# Altium schematic sheet [09] - AFE.SchDoc (part 2 of 3)
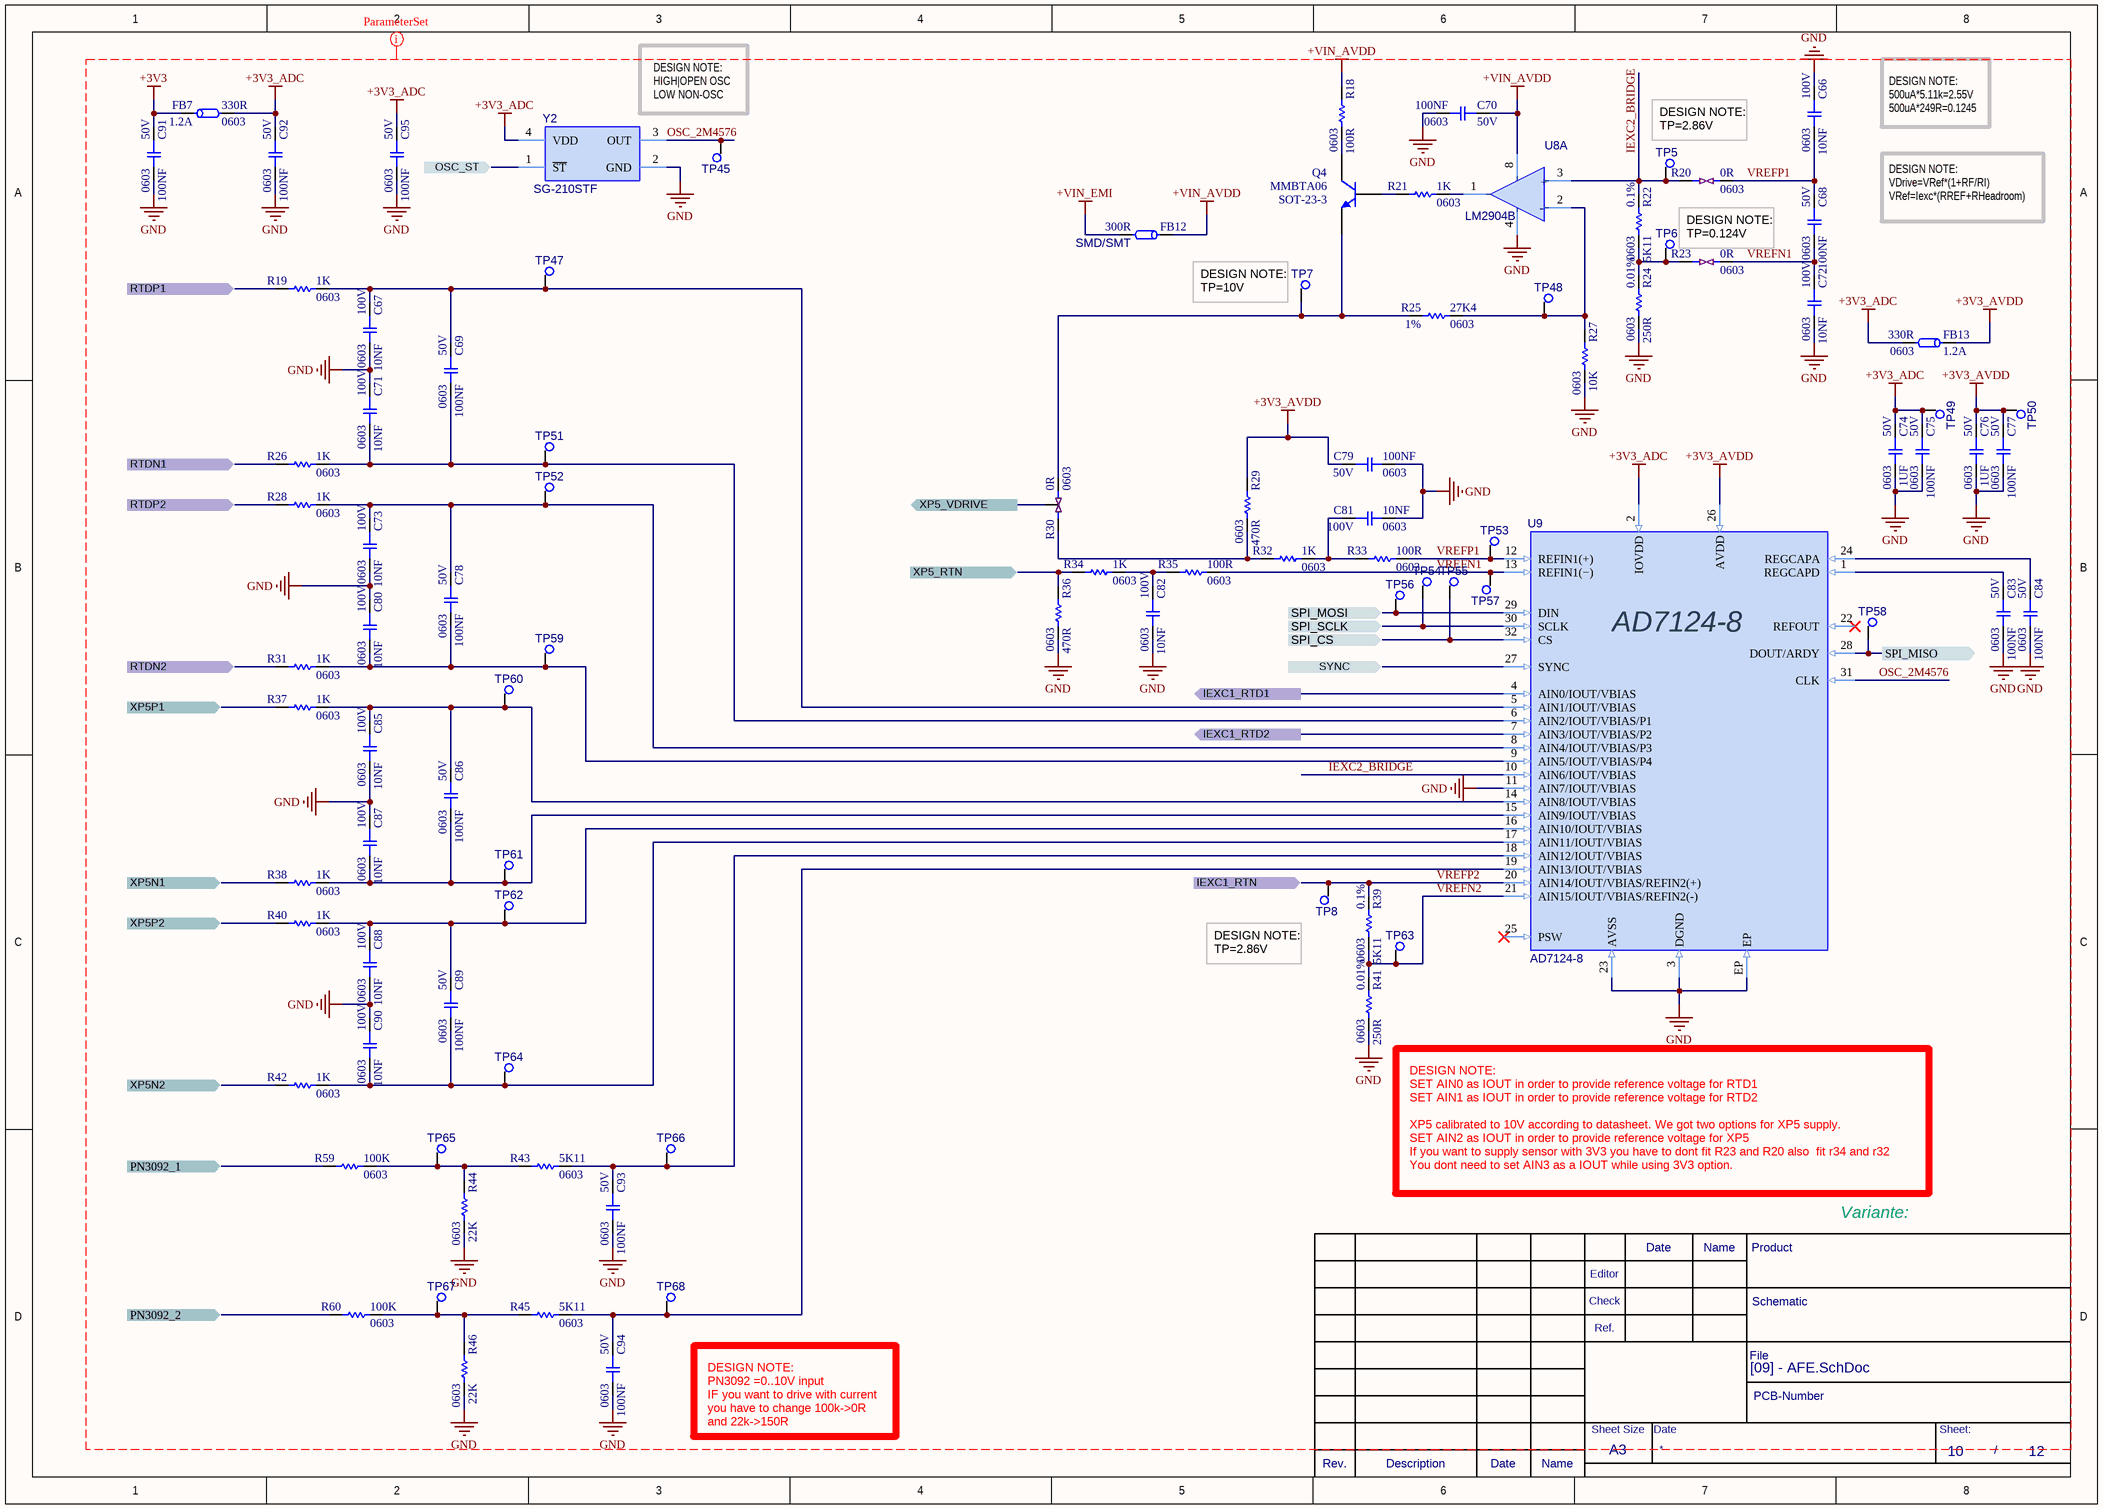
[diagram p1: [09] - AFE.SchDoc]
## Library data of the parts
C66 C72 C81 C82 = C-10NF-0603: CAP CER 10000PF 100V X7R 0603; Manufacturer: TDK; Manufacturer Part Number: C1608X7R2A103M080AA; Tolerance: 20%; Dielectric Material: Ceramic; .PCBCHK: USED; .Creator: M.OZKAN; Washability: OK; Supplier 1: Digi-Key; Supplier Part Number 1: 445-1305-6-ND; Stock 1: 40000; Pricing 1: 1=0.11, 10=0.079, 100=0.0352, 500=0.02516, 1000=0.01977 (USD); Mount: Surface Mount; Case/Package: 0603; Number of Pins: 2; Weight: 7.1E-05oz; Case Code (Metric): 1608; Min Operating Temperature: -55°C; Max Operating Temperature: 125°C; Package Quantity: 1; Capacitance: 10nF; Packaging: Tape and Reel; Voltage Rating (DC): 100V; Dielectric: X7R; Termination: SMD/SMT; Composition: Ceramic; Length: 1.6mm; Height: 0.8mm; Width: 0.031inch; Depth: 0.8mm; Thickness: 0.037inch; REACH SVHC: No SVHC; ComponentLink1URL: http://www.mouser.com/ds/2/400/lcc_commercial_general_en-837201.pdf; ComponentLink1Description: http://www.mouser.com/ds/2/400/lcc_commercial_general_en-837201.pdf; ComponentLink2URL: http://www.farnell.com/datasheets/1484596.pdf; ComponentLink2Description: http://www.farnell.com/datasheets/1484596.pdf; Stock 2: 40000; Pricing 2: 1=0.1, 10=0.066, 100=0.0293, 500=0.02092, 1000=0.01643 (USD); Features: Soft Termination; Ratings: AEC-Q200; Stock 3: 89508; Pricing 3: 1=0.13, 10=0.099, 100=0.0439, 500=0.03138, 1000=0.02465, 2500=0.02241, 5000=0.02062 (USD); Radiation Hardening: No; Lead Free: Lead Free; ComponentLink3URL: https://www.verical.com/server-webapp/html/getDatasheet?partID=126825; ComponentLink3Description: https://www.verical.com/server-webapp/html/getDatasheet?partID=126825; ComponentLink4URL: http://www.avx.com/docs/Catalogs/cauto.pdf; ComponentLink4Description: http://www.avx.com/docs/Catalogs/cauto.pdf; ComponentLink5URL: http://www.mouser.com/ds/2/40/AutoMLCC-777028.pdf; ComponentLink5Description: http://www.mouser.com/ds/2/40/AutoMLCC-777028.pdf; .SCHCHK: USED
C67 C71 C73 C80 C85 C87 C88 C90 = C-10NF-0603: CAP CER 10000PF 100V X7R 0603; Manufacturer: TDK; Manufacturer Part Number: C1608X7R2A103M080AA; Dielectric Material: Ceramic; Tolerance: 20%; .PCBCHK: USED; .Creator: M.OZKAN; Washability: OK; Supplier 1: Digi-Key; Supplier Part Number 1: 445-1305-6-ND; Stock 1: 40000; Pricing 1: 1=0.11, 10=0.079, 100=0.0352, 500=0.02516, 1000=0.01977 (USD); Mount: Surface Mount; Case/Package: 0603; Number of Pins: 2; Case Code (Metric): 1608; Min Operating Temperature: -55°C; Max Operating Temperature: 125°C; Capacitance: 10nF; Dielectric: X7R; Packaging: Tape and Reel; Package Quantity: 1; Termination: SMD/SMT; Voltage Rating (DC): 100V; Composition: Ceramic; Length: 1.6mm; Height: 0.8mm; Depth: 0.8mm; Width: 0.031inch; Thickness: 0.037inch; Radiation Hardening: No; REACH SVHC: No SVHC; Lead Free: Lead Free; ComponentLink1URL: http://www.mouser.com/ds/2/400/lcc_commercial_general_en-837201.pdf; ComponentLink1Description: http://www.mouser.com/ds/2/400/lcc_commercial_general_en-837201.pdf; ComponentLink2URL: http://www.farnell.com/datasheets/1484596.pdf; ComponentLink2Description: http://www.farnell.com/datasheets/1484596.pdf; ComponentLink3URL: https://www.verical.com/server-webapp/html/getDatasheet?partID=126825; ComponentLink3Description: https://www.verical.com/server-webapp/html/getDatasheet?partID=126825; ComponentLink4URL: http://www.avx.com/docs/Catalogs/cauto.pdf; ComponentLink4Description: http://www.avx.com/docs/Catalogs/cauto.pdf; ComponentLink5URL: http://www.mouser.com/ds/2/40/AutoMLCC-777028.pdf; ComponentLink5Description: http://www.mouser.com/ds/2/40/AutoMLCC-777028.pdf; Stock 2: 40000; Pricing 2: 1=0.1, 10=0.066, 100=0.0293, 500=0.02092, 1000=0.01643 (USD); .SCHCHK: USED; Stock 3: 89508; Pricing 3: 1=0.13, 10=0.099, 100=0.0439, 500=0.03138, 1000=0.02465, 2500=0.02241, 5000=0.02062 (USD); Weight: 7.1E-05oz; Features: Soft Termination; Ratings: AEC-Q200
C68 C75 C77 C79 C83 C84 C91 C92 C95 = C-100NF-0603: CAP CER 0.1UF 50V X7R 0603; Manufacturer: TDK; Manufacturer Part Number: C1608X7R1H104K080AA; Tolerance: 10%; Dielectric Material: Ceramic; .PCBCHK: USED; .Creator: F:TALI; Washability: OK; Temperature Coefficient: 30ppm/°C; Supplier 1: Digi-Key; Supplier Part Number 1: 445-1314-1-ND; Stock 1: 0; Pricing 1: 1=0.1, 10=0.057, 100=0.0254, 500=0.01812, 1000=0.01423 (USD); Mount: Surface Mount; Number of Pins: 2; Case Code (Metric): 1608; Min Operating Temperature: -55°C; Max Operating Temperature: 125°C; Capacitance: 100nF; Package Quantity: 1; Packaging: Tape and Reel; Voltage Rating (DC): 50V; Dielectric: X7R; Termination: SMD/SMT; Composition: Ceramic; Voltage: 50V; Length: 1.6mm; Height: 0.8mm; Width: 0.8mm; Thickness: 0.037inch; Depth: 0.8mm; Radiation Hardening: No; REACH SVHC: No SVHC; Lead Free: Lead Free; ComponentLink1URL: http://www.mouser.com/ds/2/400/lcc_commercial_general_en-837201.pdf; ComponentLink1Description: http://www.mouser.com/ds/2/400/lcc_commercial_general_en-837201.pdf; ComponentLink2URL: https://product.tdk.com/info/en/catalog/spec/mlccspec_commercial_general_midvoltage_en.pdf; ComponentLink2Description: https://product.tdk.com/info/en/catalog/spec/mlccspec_commercial_general_midvoltage_en.pdf; ComponentLink3URL: http://uk.rs-online.com/webdocs/13d1/0900766b813d1103.pdf; ComponentLink3Description: http://uk.rs-online.com/webdocs/13d1/0900766b813d1103.pdf; ComponentLink4URL: http://www.tdk.co.jp/tefe02/e412_c.pdf; ComponentLink4Description: http://www.tdk.co.jp/tefe02/e412_c.pdf; ComponentLink5URL: http://www.farnell.com/datasheets/2291921.pdf; ComponentLink5Description: http://www.farnell.com/datasheets/2291921.pdf; Supplier 2: Digi-Key; Supplier Part Number 2: 478-3540-6-ND; Stock 2: 40000; Pricing 2: 1=0.23, 10=0.161, 100=0.0756, 500=0.05304, 1000=0.0439 (USD); ComponentLink6URL: http://www.farnell.com/datasheets/1744655.pdf; ComponentLink6Description: http://www.farnell.com/datasheets/1744655.pdf; Contact Plating: Matte,Tin; ComponentLink7URL: http://catalogs.avx.com/SurfaceMount.pdf; ComponentLink7Description: http://catalogs.avx.com/SurfaceMount.pdf; ComponentLink8URL: http://www.farnell.com/datasheets/630895.pdf; ComponentLink8Description: http://www.farnell.com/datasheets/630895.pdf; ComponentLink9URL: http://www.avx.com/docs/Catalogs/cx7r.pdf; ComponentLink9Description: http://www.avx.com/docs/Catalogs/cx7r.pdf; .SCHCHK: USED; Weight: 7.1E-05oz; Features: Soft Termination; ComponentLink10URL: http://www.avx.com/docs/catalogs/cauto.pdf; ComponentLink10Description: http://www.avx.com/docs/catalogs/cauto.pdf; ComponentLink11URL: https://www.verical.com/server-webapp/html/getDatasheet?partID=98691; ComponentLink11Description: https://www.verical.com/server-webapp/html/getDatasheet?partID=98691; ComponentLink12URL: https://www.avx.com/docs/Catalogs/flexiterm.pdf; ComponentLink12Description: https://www.avx.com/docs/Catalogs/flexiterm.pdf
  C68 C75 C77 C79 C83 C84: Case Code (Imperial): 0603
  C91 C92 C95: Case/Package: 0603
C69 C78 C86 C89 = C-100NF-0603: CAP CER 0.1UF 50V X7R 0603; Manufacturer: TDK; Manufacturer Part Number: C1608X7R1H104K080AA; Tolerance: 10%; .PCBCHK: USED; .Creator: F:TALI; Washability: OK; Dielectric Material: Ceramic; Temperature Coefficient: 30ppm/°C; Supplier 1: Digi-Key; Supplier Part Number 1: 445-1314-1-ND; Stock 1: 0; Mount: Surface Mount; Weight: 7.1E-05oz; Case Code (Metric): 1608; Case Code (Imperial): 0603; Min Operating Temperature: -55°C; Max Operating Temperature: 125°C; Capacitance: 100nF; Dielectric: X7R; Packaging: Tape and Reel; Termination: SMD/SMT; Composition: Ceramic; Voltage Rating (DC): 50V; Package Quantity: 1; Length: 1.6mm; Width: 0.8mm; Thickness: 0.037inch; Lead Free: Lead Free; Supplier 2: Digi-Key; Supplier Part Number 2: 478-3540-6-ND; Stock 2: 40000; Pricing 2: 1=0.23, 10=0.161, 100=0.0756, 500=0.05304, 1000=0.0439 (USD); Height: 0.8mm; Depth: 0.8mm; Radiation Hardening: No; ComponentLink1URL: http://www.mouser.com/ds/2/400/lcc_commercial_general_en-837201.pdf; ComponentLink1Description: http://www.mouser.com/ds/2/400/lcc_commercial_general_en-837201.pdf; ComponentLink2URL: https://product.tdk.com/info/en/catalog/spec/mlccspec_commercial_general_midvoltage_en.pdf; ComponentLink2Description: https://product.tdk.com/info/en/catalog/spec/mlccspec_commercial_general_midvoltage_en.pdf; .SCHCHK: USED; Pricing 1: 1=0.1, 10=0.057, 100=0.0254, 500=0.01812, 1000=0.01423 (USD); Number of Pins: 2; Voltage: 50V; REACH SVHC: No SVHC; ComponentLink3URL: http://uk.rs-online.com/webdocs/13d1/0900766b813d1103.pdf; ComponentLink3Description: http://uk.rs-online.com/webdocs/13d1/0900766b813d1103.pdf; ComponentLink4URL: http://www.tdk.co.jp/tefe02/e412_c.pdf; ComponentLink4Description: http://www.tdk.co.jp/tefe02/e412_c.pdf; ComponentLink5URL: http://www.farnell.com/datasheets/2291921.pdf; ComponentLink5Description: http://www.farnell.com/datasheets/2291921.pdf; ComponentLink6URL: http://www.farnell.com/datasheets/1744655.pdf; ComponentLink6Description: http://www.farnell.com/datasheets/1744655.pdf; Contact Plating: Matte,Tin; Features: Soft Termination; ComponentLink7URL: http://catalogs.avx.com/SurfaceMount.pdf; ComponentLink7Description: http://catalogs.avx.com/SurfaceMount.pdf; ComponentLink8URL: http://www.farnell.com/datasheets/630895.pdf; ComponentLink8Description: http://www.farnell.com/datasheets/630895.pdf; ComponentLink9URL: http://www.avx.com/docs/Catalogs/cx7r.pdf; ComponentLink9Description: http://www.avx.com/docs/Catalogs/cx7r.pdf; ComponentLink10URL: http://www.avx.com/docs/catalogs/cauto.pdf; ComponentLink10Description: http://www.avx.com/docs/catalogs/cauto.pdf; ComponentLink11URL: https://www.verical.com/server-webapp/html/getDatasheet?partID=98691; ComponentLink11Description: https://www.verical.com/server-webapp/html/getDatasheet?partID=98691; ComponentLink12URL: https://www.avx.com/docs/Catalogs/flexiterm.pdf; ComponentLink12Description: https://www.avx.com/docs/Catalogs/flexiterm.pdf
C70 C93 C94 = C-100NF-0603: CAP CER 0.1UF 50V X7R 0603; Manufacturer: TDK; Manufacturer Part Number: C1608X7R1H104K080AA; Dielectric Material: Ceramic; Tolerance: 10%; Temperature Coefficient: 30ppm/°C; .PCBCHK: USED; .Creator: F:TALI; Washability: OK; Supplier 1: Digi-Key; Supplier Part Number 1: 445-1314-1-ND; Stock 1: 0; Pricing 1: 1=0.1, 10=0.057, 100=0.0254, 500=0.01812, 1000=0.01423 (USD); Mount: Surface Mount; Case/Package: 0603; Number of Pins: 2; Weight: 7.1E-05oz; Case Code (Metric): 1608; Min Operating Temperature: -55°C; Max Operating Temperature: 125°C; Capacitance: 100nF; Dielectric: X7R; Packaging: Tape and Reel; Package Quantity: 1; Termination: SMD/SMT; Voltage: 50V; Voltage Rating (DC): 50V; Composition: Ceramic; Length: 1.6mm; Height: 0.8mm; Depth: 0.8mm; Width: 0.8mm; Thickness: 0.037inch; Radiation Hardening: No; REACH SVHC: No SVHC; Lead Free: Lead Free; ComponentLink1URL: http://www.mouser.com/ds/2/400/lcc_commercial_general_en-837201.pdf; ComponentLink1Description: http://www.mouser.com/ds/2/400/lcc_commercial_general_en-837201.pdf; ComponentLink2URL: https://product.tdk.com/info/en/catalog/spec/mlccspec_commercial_general_midvoltage_en.pdf; ComponentLink2Description: https://product.tdk.com/info/en/catalog/spec/mlccspec_commercial_general_midvoltage_en.pdf; ComponentLink3URL: http://uk.rs-online.com/webdocs/13d1/0900766b813d1103.pdf; ComponentLink3Description: http://uk.rs-online.com/webdocs/13d1/0900766b813d1103.pdf; ComponentLink4URL: http://www.tdk.co.jp/tefe02/e412_c.pdf; ComponentLink4Description: http://www.tdk.co.jp/tefe02/e412_c.pdf; ComponentLink5URL: http://www.farnell.com/datasheets/2291921.pdf; ComponentLink5Description: http://www.farnell.com/datasheets/2291921.pdf; ComponentLink6URL: http://www.farnell.com/datasheets/1744655.pdf; ComponentLink6Description: http://www.farnell.com/datasheets/1744655.pdf; Supplier 2: Digi-Key; Supplier Part Number 2: 478-3540-6-ND; Stock 2: 40000; Pricing 2: 1=0.23, 10=0.161, 100=0.0756, 500=0.05304, 1000=0.0439 (USD); Contact Plating: Matte,Tin; Features: Soft Termination; ComponentLink7URL: http://catalogs.avx.com/SurfaceMount.pdf; ComponentLink7Description: http://catalogs.avx.com/SurfaceMount.pdf; ComponentLink8URL: http://www.farnell.com/datasheets/630895.pdf; ComponentLink8Description: http://www.farnell.com/datasheets/630895.pdf; ComponentLink9URL: http://www.avx.com/docs/Catalogs/cx7r.pdf; ComponentLink9Description: http://www.avx.com/docs/Catalogs/cx7r.pdf; ComponentLink10URL: http://www.avx.com/docs/catalogs/cauto.pdf; ComponentLink10Description: http://www.avx.com/docs/catalogs/cauto.pdf; ComponentLink11URL: https://www.verical.com/server-webapp/html/getDatasheet?partID=98691; ComponentLink11Description: https://www.verical.com/server-webapp/html/getDatasheet?partID=98691; ComponentLink12URL: https://www.avx.com/docs/Catalogs/flexiterm.pdf; ComponentLink12Description: https://www.avx.com/docs/Catalogs/flexiterm.pdf; .SCHCHK: USED
C74 C76 = C-1UF-0603_1: CAP CER 1UF 50V X7R 0603; Manufacturer: Yageo; Manufacturer Part Number: CC0603KRX7R9BB105; Tolerance: 10%; .PCBCHK: USED; .Creator: M.OZKAN; Washability: OK; Supplier 1: Digi-Key; Supplier Part Number 1: 311-2082-1-ND; Stock 1: 0; Mount: Surface Mount; Weight: 7.1E-05oz; Case Code (Metric): 1608; Case Code (Imperial): 0603; Min Operating Temperature: -55°C; Max Operating Temperature: 125°C; Capacitance: 1uF; Dielectric: X7R; Packaging: Tape and Reel; Termination: SMD/SMT; Composition: Ceramic; Voltage Rating (DC): 50V; Package Quantity: 4000; Length: 0.063inch; Width: 0.031inch; Thickness: 0.035inch; Lead Free: Lead Free; Halogen Free: Halogen Free; Supplier 2: Digi-Key; Supplier Part Number 2: 587-3247-6-ND; Stock 2: 0; Pricing 2: 1=0.29, 10=0.198, 100=0.1124, 500=0.07936, 1000=0.06943 (USD); Height: 0.8mm; Depth: 0.8mm; Radiation Hardening: No; ComponentLink1URL: https://www.yuden.co.jp/productdata/catalog/mlcc_all_e.pdf; ComponentLink1Description: https://www.yuden.co.jp/productdata/catalog/mlcc_all_e.pdf; Supplier 3: Digi-Key; Supplier Part Number 3: 478-10073-6-ND; Stock 3: 0; Pricing 3: 1=0.73, 10=0.519, 100=0.3416, 500=0.253, 1000=0.21505 (USD); ComponentLink2URL: http://datasheet.octopart.com/06035C105KAT2A-AVX-datasheet-13516023.pdf; ComponentLink2Description: http://datasheet.octopart.com/06035C105KAT2A-AVX-datasheet-13516023.pdf; .SCHCHK: USED
FB7 FB13 = FB-330R-0603: FERRITE BEAD 330 OHM 0603 1LN; Manufacturer: Murata; Manufacturer Part Number: BLM18PG331SN1D; Material: Steel,Ferrite; Tolerance: 25%; DC Resistance (DCR): 150mR; Number of Lines: 1; Test Frequency: 100MHz; Shielding: Unshielded; Washability: OK; .Creator: M.OZKAN; .PCBCHK: USED; Supplier 1: Digi-Key; RoHS: Yes; Number of Pins: 2; Core Material: Ferrite; Case Code (Metric): 1608; Case Code (Imperial): 0603; Min Operating Temperature: -55°C; Max Operating Temperature: 125°C; Impedance: 330R; Package Quantity: 1; Packaging: Tape and Reel; Current Rating: 1.2A; Max Current Rating: 1.2A; Termination: SMD/SMT; Number of Circuits: 1; Length: 1.75mm; Height: 0.8mm; Width: 0.8mm; Depth: 0.95mm; Radiation Hardening: No; REACH SVHC: No SVHC; Lead Free: Lead Free; ComponentLink1URL: https://datasheet.ciiva.com/6211/enfa0003-6211710.pdf?src-supplier=Digi-Key; ComponentLink1Description: https://datasheet.ciiva.com/6211/enfa0003-6211710.pdf?src-supplier=Digi-Key; Supplier Part Number 1: 490-5222-1-ND; Max DC Current: 1.2A; .SCHCHK: USED; Stock: 106218; Pricing: 1=0.1, 10=0.076, 25=0.0684, 50=0.05, 100=0.0433, 250=0.0342, 500=0.0288, 1000=0.0243 (USD)
FB12 = FB-300R-1206: FERRITE BEAD 300 OHM 1206 1LN; Manufacturer: Wurth Electronics; Manufacturer Part Number: 742792121; Tolerance: 25%; DC Resistance (DCR): 60mR; Current Rating: 3A; Number of Lines: 1; Test Frequency: 110MHz; Washability: OK; .Creator: F:TALI; .PCBCHK: USED; Inductance: 560nh; Supplier 1: Digi-Key; Core Material: Ferrite; Case Code (Metric): 3216; Case Code (Imperial): 1206; Material: Ferrite; Min Operating Temperature: -55°C; Max Operating Temperature: 125°C; Impedance: 300R; Package Quantity: 3000; Packaging: Tape and Reel; Max Current Rating: 3A; Termination: SMD/SMT; Length: 3.2mm; Height: 1.1mm; Width: 1.6mm; Depth: 1.6mm; REACH SVHC: Unknown; ComponentLink1URL: http://katalog.we-online.de/pbs/datasheet/742792121.pdf; ComponentLink1Description: http://katalog.we-online.de/pbs/datasheet/742792121.pdf; Supplier Part Number 1: 732-4654-6-ND; Max DC Current: 3A; .SCHCHK: USED; Stock 1: 17747; Pricing 1: 1=0.24, 10=0.238, 50=0.219, 100=0.209, 500=0.2, 1000=0.19 (USD); Mount: Surface Mount; Weight: 0.000353oz; ComponentLink2URL: http://www.farnell.com/datasheets/1910965.pdf; ComponentLink2Description: http://www.farnell.com/datasheets/1910965.pdf; ComponentLink3URL: http://documents.rs-components.com/techlib://itc_doclist_GB.htm?stockno=6694137; ComponentLink3Description: http://documents.rs-components.com/techlib://itc_doclist_GB.htm?stockno=6694137; ComponentLink4URL: http://www.produktinfo.conrad.com/datenblaetter/1000000-1099999/001086998-da-01-ml-WE_CBF_SMD_FERRIT_742792121_de_en.pdf; ComponentLink4Description: http://www.produktinfo.conrad.com/datenblaetter/1000000-1099999/001086998-da-01-ml-WE_CBF_SMD_FERRIT_742792121_de_en.pdf
Q4 = Q-MMBTA06: TRANS NPN 80V 0.5A SOT23; Manufacturer: ON Semiconductor; Manufacturer Part Number: MMBTA06LT1G; .Creator: F:TALI; .PCBCHK: USED; Max Power Dissipation: 225mW; Number of Elements: 1; Frequency: 100MHz; Emitter Base Voltage (VEBO): 4V; Collector Emitter Saturation Voltage: 250mV; Max Collector Current: 500mA; Power Dissipation: 300mW; Element Configuration: Single; hFE Min: 100; ComponentLink1URL: http://www.fairchildsemi.com/ds/MM/MMBTA06.pdf; ComponentLink1Description: http://www.fairchildsemi.com/ds/MM/MMBTA06.pdf; ComponentLink2URL: http://www.farnell.com/datasheets/48137.pdf; ComponentLink2Description: http://www.farnell.com/datasheets/48137.pdf; ComponentLink3URL: http://www.farnell.com/datasheets/1852077.pdf; ComponentLink3Description: http://www.farnell.com/datasheets/1852077.pdf; ComponentLink4URL: http://www.fairchildsemi.com/datasheets/MP/MPSA06.pdf; ComponentLink4Description: http://www.fairchildsemi.com/datasheets/MP/MPSA06.pdf; ComponentLink5URL: http://www.mouser.com/ds/2/149/MMBTA06-196120.pdf; ComponentLink5Description: http://www.mouser.com/ds/2/149/MMBTA06-196120.pdf; ComponentLink6URL: https://www.verical.com/server-webapp/html/getDatasheet?partID=130058; ComponentLink6Description: https://www.verical.com/server-webapp/html/getDatasheet?partID=130058; .SCHCHK: USED; Supplier 1: Digi-Key; Supplier Part Number 1: MMBTA06LT1GOSCT-ND; Stock: 165416; Pricing: 1=0.16, 10=0.15, 25=0.1424, 100=0.0627, 250=0.0602, 500=0.0492, 1000=0.0342 (USD); RoHS: Yes; Number of Pins: 3; Contact Plating: Tin,Matte; Min Operating Temperature: -55°C; Max Operating Temperature: 150°C; Package Quantity: 1; Collector Emitter Voltage (VCEO): 80V; Packaging: Tape and Reel; Polarity: NPN; Collector Base Voltage (VCBO): 80V; Collector Emitter Breakdown Voltage: 80V; Transition Frequency: 100MHz; Max Breakdown Voltage: 80V; Max Frequency: 100MHz; Gain Bandwidth Product: 100MHz; Voltage Rating (DC): 80V; Current Rating: 500mA; Length: 0.119inch; Height: 0.04inch; Width: 0.055inch; Radiation Hardening: No; REACH SVHC: No SVHC; Lead Free: Lead Free; ComponentLink7URL: https://datasheet.ciiva.com/4722/mmbta05lt1-d-101659-4722113.pdf?src-supplier=Mouser; ComponentLink7Description: https://datasheet.ciiva.com/4722/mmbta05lt1-d-101659-4722113.pdf?src-supplier=Mouser; ComponentLink8URL: https://datasheet.ciiva.com/15139/getdatasheetpartid-137838-15139444.pdf?src-supplier=Verical; ComponentLink8Description: https://datasheet.ciiva.com/15139/getdatasheetpartid-137838-15139444.pdf?src-supplier=Verical; ComponentLink9URL: https://datasheet.ciiva.com/16465/mmbta05lt1-d-16465685.pdf?src-supplier=Future+Electronics; ComponentLink9Description: https://datasheet.ciiva.com/16465/mmbta05lt1-d-16465685.pdf?src-supplier=Future+Electronics; ComponentLink10URL: https://datasheet.ciiva.com/11197/mmbta05lt1-d-11197414.pdf?src-supplier=Avnet; ComponentLink10Description: https://datasheet.ciiva.com/11197/mmbta05lt1-d-11197414.pdf?src-supplier=Avnet; ComponentLink11URL: https://datasheet.ciiva.com/11198/mmbta05lt1-d-11198678.pdf?src-supplier=Avnet; ComponentLink11Description: https://datasheet.ciiva.com/11198/mmbta05lt1-d-11198678.pdf?src-supplier=Avnet; ComponentLink12URL: https://datasheet.ciiva.com/976/mmbta05lt1-d-976473.pdf?src-supplier=Digi-Key; ComponentLink12Description: https://datasheet.ciiva.com/976/mmbta05lt1-d-976473.pdf?src-supplier=Digi-Key; ComponentLink13URL: https://datasheet.ciiva.com/976/mmbta05lt1-d-976474.pdf?src-supplier=Digi-Key; ComponentLink13Description: https://datasheet.ciiva.com/976/mmbta05lt1-d-976474.pdf?src-supplier=Digi-Key; ComponentLink14URL: https://datasheet.ciiva.com/976/mmbta05lt1-d-976475.pdf?src-supplier=Digi-Key; ComponentLink14Description: https://datasheet.ciiva.com/976/mmbta05lt1-d-976475.pdf?src-supplier=Digi-Key; ComponentLink15URL: https://datasheet.ciiva.com/7972/mmbta05lt1-d-7972078.pdf?src-supplier=Element14; ComponentLink15Description: https://datasheet.ciiva.com/7972/mmbta05lt1-d-7972078.pdf?src-supplier=Element14; ComponentLink16URL: https://datasheet.ciiva.com/16478/mmbta05lt1-d-16478574.pdf?src-supplier=Avnet+Asia; ComponentLink16Description: https://datasheet.ciiva.com/16478/mmbta05lt1-d-16478574.pdf?src-supplier=Avnet+Asia; ComponentLink17URL: https://datasheet.ciiva.com/25998/mmbta05lt1-d-25998830.pdf?src-supplier=Avnet+Europe; ComponentLink17Description: https://datasheet.ciiva.com/25998/mmbta05lt1-d-25998830.pdf?src-supplier=Avnet+Europe
R18 R33 R35 = R-100R-0603: RES SMD 100 OHM 1% 1/8W 0603; Manufacturer: Stackpole Electronics; Manufacturer Part Number: RNCP0603FTD100R; Max Power Dissipation: 125mW; Temperature Coefficient: 100ppm/°C; Voltage Rating (DC): 50V; Power Rating: 100mW; Number of Resistors: 1; .PCBCHK: USED; .Creator: F:TALI; Washability: OK; Supplier 1: Digi-Key; Supplier Part Number 1: RNCP0603FTD100RDKR-ND; Stock 1: 0; Pricing 1: 1=0.1, 10=0.067, 100=0.0273, 1000=0.01224, 2500=0.01063 (USD); Mount: Surface Mount; Case/Package: 0603; Case Code (Metric): 1608; Contact Plating: Matte,Tin; Min Operating Temperature: -55°C; Max Operating Temperature: 155°C; Resistance: 100R; Tolerance: 1%; Packaging: Tape and Reel; Composition: Thin Film; Number of Terminations: 2; Features: Anti-Sulfur,Moisture Resistant; Length: 0.059inch; Height: 0.02inch; Width: 0.031inch; Radiation Hardening: No; Lead Free: Lead Free; Supplier 2: Digi-Key; Supplier Part Number 2: 311-100HRDKR-ND; Stock 2: 30225949; Pricing 2: 1=0.1, 10=0.026, 100=0.0107, 1000=0.00478, 2500=0.00415 (USD); Number of Pins: 2; Voltage Rating: 50V; Termination: SMD/SMT; Military Standard: Not; Depth: 0.8mm; REACH SVHC: Unknown; ComponentLink1URL: http://www.farnell.com/datasheets/1868787.pdf; ComponentLink1Description: http://www.farnell.com/datasheets/1868787.pdf; ComponentLink2URL: http://documents.rs-components.com/techlib://itc_doclist_GB.htm?stockno=5048912; ComponentLink2Description: http://documents.rs-components.com/techlib://itc_doclist_GB.htm?stockno=5048912; ComponentLink3URL: http://www.farnell.com/datasheets/1686128.pdf; ComponentLink3Description: http://www.farnell.com/datasheets/1686128.pdf; ComponentLink4URL: http://www.farnell.com/datasheets/1738695.pdf; ComponentLink4Description: http://www.farnell.com/datasheets/1738695.pdf; ComponentLink5URL: http://www.farnell.com/datasheets/443971.pdf; ComponentLink5Description: http://www.farnell.com/datasheets/443971.pdf; Supplier 3: Digi-Key; Supplier Part Number 3: A106047TR-ND; Stock 3: 0; Weight: 7.1E-05oz; Package Quantity: 5000; ELV: Compliant; ComponentLink6URL: http://uk.rs-online.com/webdocs/1380/0900766b813807f7.pdf; ComponentLink6Description: http://uk.rs-online.com/webdocs/1380/0900766b813807f7.pdf; ComponentLink7URL: https://www.alliedelec.com/m/d/dd92310293d361ca5b4f9a8a31ebf2ac.pdf; ComponentLink7Description: https://www.alliedelec.com/m/d/dd92310293d361ca5b4f9a8a31ebf2ac.pdf; .SCHCHK: USED
R19 R21 R26 R28 R31 R32 R34 R37 R38 R40 R42 = R-1K-0603: RES SMD 1K OHM 5% 1/10W 0603; Manufacturer: Yageo; Manufacturer Part Number: RC0603JR-071KL; Resistance: 1kR; Temperature Coefficient: 100ppm/°C; Voltage Rating (DC): 50V; Power Rating: 100mW; .PCBCHK: USED; .Creator: F:TALI; Washability: OK; Supplier 1: Digi-Key; Supplier Part Number 1: 311-1.0KGRCT-ND; Stock 1: 16415399; Pricing 1: 1=0.09, 10=0.019, 100=0.0077, 1000=0.00346, 2500=0.00301 (EUR); Case/Package: 0603; Number of Pins: 2; Contact Plating: Matte,Tin; Case Code (Metric): 1608; Min Operating Temperature: -55°C; Max Operating Temperature: 155°C; Tolerance: 5%; Composition: Thick Film; Packaging: Tape and Reel; Package Quantity: 5000; Voltage Rating: 50V; Termination: SMD/SMT; Military Standard: Not; Length: 1.6mm; Height: 0.45mm; Width: 0.8mm; Depth: 0.8mm; Radiation Hardening: No; REACH SVHC: Unknown; Lead Free: Lead Free; ComponentLink1URL: http://www.yageo.com/documents/recent/PYu-RC_Group_51_RoHS_L_2.pdf; ComponentLink1Description: http://www.yageo.com/documents/recent/PYu-RC_Group_51_RoHS_L_2.pdf; ComponentLink2URL: http://www.farnell.com/datasheets/443971.pdf; ComponentLink2Description: http://www.farnell.com/datasheets/443971.pdf; Supplier 2: Digi-Key; Supplier Part Number 2: YAG1311CT-ND; Stock 2: 9; Pricing 2: 1=0.1, 10=0.044, 100=0.0178, 1000=0.00798, 2500=0.00693 (USD); Number of Terminations: 2; Max Power Dissipation: 100mW; Features: Moisture Resistant; Supplier Part Number 3: SMD0603-1K; Stock 3: 0; Pricing 3: 100=0.0125, 1000=0.0035, 5000=0.002, 15000=0.00165, 50000=0.0014 (USD); Supplier 3: Ozdisan; .SCHCHK: USED
R20 R23 = R-0R-0603: RES SMD 0 OHM 1/10W JUMP 0603; Manufacturer: Yageo; Manufacturer Part Number: RC0603JR-070RL; Resistance: 0mR; Tolerance: 1%; Power Rating: 100mW; Voltage Rating (DC): 50V; Temperature Coefficient: 200ppm/°C; Current Rating: 1A; Working Voltage: 75V; .PCBCHK: USED; .Creator: F:TALI; Washability: OK; Supplier 1: Digi-Key; Supplier Part Number 1: 311-0.0GRDKR-ND; Stock 1: 54397731; Pricing 1: 1=0.1, 10=0.021, 25=0.0152, 50=0.0114, 100=0.0084, 250=0.00644, 500=0.00514, 1000=0.00379 (USD); Case/Package: 0603; Number of Pins: 2; Contact Plating: Matte,Tin; Case Code (Metric): 1608; Min Operating Temperature: -55°C; Max Operating Temperature: 155°C; Composition: Thick Film; Packaging: Tape and Reel; Termination: SMD/SMT; Package Quantity: 5000; Voltage Rating: 50V; Military Standard: Not; Length: 1.6mm; Height: 0.45mm; Width: 0.8mm; Depth: 0.8mm; Radiation Hardening: No; REACH SVHC: No SVHC; Lead Free: Lead Free; ComponentLink1URL: http://www.farnell.com/datasheets/1738695.pdf; ComponentLink1Description: http://www.farnell.com/datasheets/1738695.pdf; ComponentLink2URL: https://www.verical.com/server-webapp/html/getDatasheet?partID=329462; ComponentLink2Description: https://www.verical.com/server-webapp/html/getDatasheet?partID=329462; ComponentLink3URL: http://www.yageo.com/documents/recent/PYu-RC_Group_51_RoHS_L_9.pdf; ComponentLink3Description: http://www.yageo.com/documents/recent/PYu-RC_Group_51_RoHS_L_9.pdf; ComponentLink4URL: http://www.farnell.com/datasheets/443971.pdf; ComponentLink4Description: http://www.farnell.com/datasheets/443971.pdf; ComponentLink5URL: http://documents.rs-components.com/techlib://itc_doclist_GB.htm?stockno=6515918; ComponentLink5Description: http://documents.rs-components.com/techlib://itc_doclist_GB.htm?stockno=6515918; Supplier 2: Digi-Key; Supplier Part Number 2: 311-0.0HRDKR-ND; Stock 2: 6104331; Pricing 2: 1=0.1, 10=0.021, 25=0.0152, 50=0.0114, 100=0.0084, 250=0.00644, 500=0.00514, 1000=0.00379 (USD); Number of Terminations: 2; Max Power Dissipation: 100mW; Features: Moisture Resistant; ComponentLink6URL: http://www.farnell.com/datasheets/1868787.pdf; ComponentLink6Description: http://www.farnell.com/datasheets/1868787.pdf; ComponentLink7URL: http://documents.rs-components.com/techlib://itc_doclist_GB.htm?stockno=5048827; ComponentLink7Description: http://documents.rs-components.com/techlib://itc_doclist_GB.htm?stockno=5048827; Supplier 3: Digi-Key; Supplier Part Number 3: P0.0GDKR-ND; Stock 3: 34178498; Pricing 3: 1=0.1, 10=0.042, 25=0.0304, 50=0.0232, 100=0.0171, 250=0.01308, 500=0.01046, 1000=0.0077 (USD); Mount: Surface Mount; ComponentLink8URL: http://industrial.panasonic.com/www-data/pdf/AOA0000/AOA0000CE1.pdf; ComponentLink8Description: http://industrial.panasonic.com/www-data/pdf/AOA0000/AOA0000CE1.pdf; ComponentLink9URL: http://www.farnell.com/datasheets/2059623.pdf; ComponentLink9Description: http://www.farnell.com/datasheets/2059623.pdf; ComponentLink10URL: http://www.jameco.com/Jameco/Products/ProdDS/1935748.pdf; ComponentLink10Description: http://www.jameco.com/Jameco/Products/ProdDS/1935748.pdf; ComponentLink11URL: http://www.farnell.com/datasheets/1678796.pdf; ComponentLink11Description: http://www.farnell.com/datasheets/1678796.pdf; ComponentLink12URL: http://www.alliedelec.com/m/d/51cd0790071e1666bdb9d00c57fcf960.pdf; ComponentLink12Description: http://www.alliedelec.com/m/d/51cd0790071e1666bdb9d00c57fcf960.pdf; .SCHCHK: USED
R22 R39 = R-5K11-0603: RES SMD 5.11KOHM 0.1% 1/10W 0603; Manufacturer: Panasonic; Manufacturer Part Number: ERA-3AEB5111V; Resistance: 5.11kR; Temperature Coefficient: 25ppm/°C; Power Rating: 100mW; Voltage Rating: 75V; Supplier 1: Digi-Key; Supplier Part Number 1: P5.11KDBCT-ND; Stock: 711; Pricing: 1=0.33, 10=0.275, 100=0.1076, 1000=0.045, 2500=0.0413 (USD); RoHS: Yes; Mount: Surface Mount; Number of Pins: 2; Weight: 7.1E-05oz; Contact Plating: Tin; Case Code (Metric): 1608; Case Code (Imperial): 0603; Min Operating Temperature: -55°C; Max Operating Temperature: 155°C; Composition: Thin Film,Metal Film; Packaging: Tape and Reel; Package Quantity: 5000; Number of Terminations: 2; Termination: SMD/SMT; Military Standard: Not; Max Power Dissipation: 100mW; Voltage Rating (DC): 75V; Features: Automotive AEC-Q200; Length: 1.6mm; Height: 0.45mm; Width: 0.8mm; Depth: 0.8mm; Radiation Hardening: No; REACH SVHC: No SVHC; Lead Free: Lead Free; ComponentLink1URL: https://datasheet.ciiva.com/11810/0900766b80eb1d8c-11810822.pdf?src-supplier=RSComponents; ComponentLink1Description: https://datasheet.ciiva.com/11810/0900766b80eb1d8c-11810822.pdf?src-supplier=RSComponents; ComponentLink2URL: https://datasheet.ciiva.com/29183/451892-da-01-en-widerstand-0603-era-29183907.pdf?src-supplier=Conrad; ComponentLink2Description: https://datasheet.ciiva.com/29183/451892-da-01-en-widerstand-0603-era-29183907.pdf?src-supplier=Conrad; ComponentLink3URL: https://datasheet.ciiva.com/24159/aoa0000ce26-197354-24159541.pdf?src-supplier=Mouser; ComponentLink3Description: https://datasheet.ciiva.com/24159/aoa0000ce26-197354-24159541.pdf?src-supplier=Mouser; ComponentLink4URL: https://datasheet.ciiva.com/5968/485442-5968872.pdf?src-supplier=Farnell; ComponentLink4Description: https://datasheet.ciiva.com/5968/485442-5968872.pdf?src-supplier=Farnell; ComponentLink5URL: https://datasheet.ciiva.com/5968/485442-5968873.pdf?src-supplier=Farnell; ComponentLink5Description: https://datasheet.ciiva.com/5968/485442-5968873.pdf?src-supplier=Farnell; ComponentLink6URL: https://datasheet.ciiva.com/5968/485442-5968874.pdf?src-supplier=Farnell; ComponentLink6Description: https://datasheet.ciiva.com/5968/485442-5968874.pdf?src-supplier=Farnell; ComponentLink7URL: https://datasheet.ciiva.com/9195/aoa0000ce26-9195515.pdf?src-supplier=Avnet; ComponentLink7Description: https://datasheet.ciiva.com/9195/aoa0000ce26-9195515.pdf?src-supplier=Avnet; ComponentLink8URL: https://datasheet.ciiva.com/5968/485442-5968876.pdf?src-supplier=Farnell; ComponentLink8Description: https://datasheet.ciiva.com/5968/485442-5968876.pdf?src-supplier=Farnell; ComponentLink9URL: https://datasheet.ciiva.com/7861/485442-7861692.pdf?src-supplier=Element14; ComponentLink9Description: https://datasheet.ciiva.com/7861/485442-7861692.pdf?src-supplier=Element14; ComponentLink10URL: https://datasheet.ciiva.com/7861/485442-7861693.pdf?src-supplier=Element14; ComponentLink10Description: https://datasheet.ciiva.com/7861/485442-7861693.pdf?src-supplier=Element14
R24 R41 = R-250R-0603: RES 250 OHM 0.01% 1/10W 0603; Manufacturer: Stackpole Electronics; Manufacturer Part Number: RNCF0603TKY250R; Max Power Dissipation: 100mW; Temperature Coefficient: 5ppm/°C; Supplier 1: Digi-Key; Supplier Part Number 1: RNCF0603TKY250RCT-ND; Stock: 3231; Pricing: 1=1.86, 10=1.65, 100=1.26 (USD); RoHS: Yes; Mount: Surface Mount; Case Code (Metric): 1608; Case Code (Imperial): 0603; Min Operating Temperature: -55°C; Max Operating Temperature: 155°C; Packaging: Tape and Reel; Resistance: 250R; Features: Moisture Resistant; Number of Terminations: 2; Length: 0.063inch; Height: 0.022inch; Width: 0.031inch; ComponentLink1URL: https://www.seielect.com/catalog/SEI-Packaging.pdf?src-supplier=Digi-Key; ComponentLink1Description: https://www.seielect.com/catalog/SEI-Packaging.pdf?src-supplier=Digi-Key; Resistor Type: Thin Film
R25 = R-27K4-0603: RES 27.4K OHM 1% 1/10W 0603; Manufacturer: Stackpole Electronics; Manufacturer Part Number: RMCF0603FT27K4; Max Power Dissipation: 100mW; Temperature Coefficient: 100ppm/°C; Resistance: 27.4kR; Supplier 1: Digi-Key; Supplier Part Number 1: RMCF0603FT27K4CT-ND; Stock: 261106; Pricing: 1=0.1, 10=0.015, 100=0.0063, 1000=0.0028, 2500=0.0024 (USD); RoHS: Yes; Mount: Surface Mount; Contact Plating: Tin,Matte; Case Code (Imperial): 0603; Case Code (Metric): 1608; Min Operating Temperature: -55°C; Max Operating Temperature: 155°C; Composition: Thick Film; Number of Terminations: 2; Military Standard: Not; Packaging: Tape and Reel; Power Rating: 100mW; Features: Automotive AEC-Q200; Length: 0.061inch; Height: 0.022inch; Depth: 0.8mm; Width: 0.031inch; Radiation Hardening: No; Lead Free: Lead Free; ComponentLink1URL: https://datasheet.ciiva.com/26835/getdatasheetpartid-698873-26835626.pdf?src-supplier=Verical; ComponentLink1Description: https://datasheet.ciiva.com/26835/getdatasheetpartid-698873-26835626.pdf?src-supplier=Verical
R27 = R-10K-0603: RES SMD 10K OHM 1% 1/10W 0603; Manufacturer: Yageo; Manufacturer Part Number: RC0603FR-0710KL; Resistance: 10kR; Temperature Coefficient: 100ppm/°C; Voltage Rating (DC): 50V; Power Rating: 100mW; Voltage Rating: 75V; .PCBCHK: USED; .Creator: F:TALI; Washability: OK; Supplier 1: Digi-Key; Supplier Part Number 1: 311-10.0KHRCT-ND; Stock 1: 37479107; Pricing 1: 1=0.1, 10=0.026, 100=0.0107, 1000=0.00478, 2500=0.00415 (USD); Case/Package: 0603; Number of Pins: 2; Weight: 7.1E-05oz; Case Code (Metric): 1608; Min Operating Temperature: -55°C; Max Operating Temperature: 155°C; Tolerance: 1%; Composition: Thick Film; Packaging: Tape and Reel; Military Standard: Not; Termination: SMD/SMT; Length: 1.6mm; Height: 0.45mm; Width: 0.8mm; Depth: 0.8mm; Lead Pitch: 0.3mm; REACH SVHC: No SVHC; Lead Free: Lead Free; ComponentLink1URL: http://www.farnell.com/datasheets/38590.pdf; ComponentLink1Description: http://www.farnell.com/datasheets/38590.pdf; ComponentLink2URL: https://www.verical.com/server-webapp/html/getDatasheet?partID=409289; ComponentLink2Description: https://www.verical.com/server-webapp/html/getDatasheet?partID=409289; ComponentLink3URL: http://www.farnell.com/datasheets/1868787.pdf; ComponentLink3Description: http://www.farnell.com/datasheets/1868787.pdf; ComponentLink4URL: http://www.farnell.com/datasheets/443971.pdf; ComponentLink4Description: http://www.farnell.com/datasheets/443971.pdf; ComponentLink5URL: http://www.farnell.com/datasheets/1738695.pdf; ComponentLink5Description: http://www.farnell.com/datasheets/1738695.pdf; Supplier 2: Digi-Key; Supplier Part Number 2: 311-10KGRDKR-ND; Stock 2: 34952003; Pricing 2: 1=0.1, 10=0.022, 100=0.0088, 1000=0.00396, 2500=0.00344 (USD); Contact Plating: Matte,Tin; Radiation Hardening: No; ComponentLink6URL: http://www.yageo.com/documents/recent/PYu-RC_Group_51_RoHS_L_9.pdf; ComponentLink6Description: http://www.yageo.com/documents/recent/PYu-RC_Group_51_RoHS_L_9.pdf; ComponentLink7URL: https://www.verical.com/server-webapp/html/getDatasheet?partID=327958; ComponentLink7Description: https://www.verical.com/server-webapp/html/getDatasheet?partID=327958; ComponentLink8URL: http://www.yageo.com/documents/recent/PYu-RC_Group_51_RoHS_L_2.pdf; ComponentLink8Description: http://www.yageo.com/documents/recent/PYu-RC_Group_51_RoHS_L_2.pdf; Mount: Surface Mount; Package Quantity: 1; Number of Terminations: 2; Max Power Dissipation: 100mW; Working Voltage: 75V; Features: Automotive AEC-Q200; ComponentLink9URL: http://www.farnell.com/datasheets/1678796.pdf; ComponentLink9Description: http://www.farnell.com/datasheets/1678796.pdf; ComponentLink10URL: http://industrial.panasonic.com/www-cgi/jvcr13pz.cgi?E+PZ+3+AOA0002+ERJ1GNJ120C+7+WW; ComponentLink10Description: http://industrial.panasonic.com/www-cgi/jvcr13pz.cgi?E+PZ+3+AOA0002+ERJ1GNJ120C+7+WW; ComponentLink11URL: http://industrial.panasonic.com/www-data/pdf/AOA0000/AOA0000CE1.pdf; ComponentLink11Description: http://industrial.panasonic.com/www-data/pdf/AOA0000/AOA0000CE1.pdf; ComponentLink12URL: http://www.jameco.com/Jameco/Products/ProdDS/2007265.pdf; ComponentLink12Description: http://www.jameco.com/Jameco/Products/ProdDS/2007265.pdf; ComponentLink13URL: https://industrial.panasonic.com/cdbs/www-data/pdf/RDA0000/AOA0000C301.pdf; ComponentLink13Description: https://industrial.panasonic.com/cdbs/www-data/pdf/RDA0000/AOA0000C301.pdf; Supplier 3: Digi-Key; Supplier Part Number 3: YAG1290DKR-ND; Stock 3: 0; Pricing 3: 1=0.1, 10=0.044, 100=0.0178, 1000=0.00798, 2500=0.00693 (USD); .SCHCHK: USED
R29 R36 = R-470R-0603: RES SMD 470 OHM 5% 1/10W 0603; Manufacturer: Yageo; Manufacturer Part Number: RC0603JR-07470RL; Temperature Coefficient: 100ppm/°C; Voltage Rating (DC): 50V; Power Rating: 100mW; .PCBCHK: USED; .Creator: F:TALI; Washability: OK; Supplier 1: Digi-Key; Supplier Part Number 1: 311-470GRDKR-ND; Stock 1: 0; Pricing 1: 1=0.1, 10=0.022, 100=0.0088, 1000=0.00396, 2500=0.00344 (USD); Case/Package: 0603; Number of Pins: 2; Case Code (Metric): 1608; Min Operating Temperature: -55°C; Max Operating Temperature: 155°C; Resistance: 470R; Tolerance: 5%; Composition: Thick Film; Packaging: Tape and Reel; Voltage Rating: 50V; Package Quantity: 1; Termination: SMD/SMT; Number of Terminations: 2; Military Standard: Not; Max Power Dissipation: 100mW; Features: Moisture Resistant; Length: 0.063inch; Height: 0.022inch; Width: 0.031inch; Depth: 0.8mm; REACH SVHC: No SVHC; Lead Free: Lead Free; ComponentLink1URL: http://www.yageo.com/documents/recent/PYu-RC_Group_51_RoHS_L_9.pdf; ComponentLink1Description: http://www.yageo.com/documents/recent/PYu-RC_Group_51_RoHS_L_9.pdf; ComponentLink2URL: http://www.farnell.com/datasheets/443971.pdf; ComponentLink2Description: http://www.farnell.com/datasheets/443971.pdf; Supplier 2: Digi-Key; Supplier Part Number 2: YAG1301DKR-ND; Stock 2: 2603; Pricing 2: 1=0.1, 10=0.044, 100=0.0178, 1000=0.00798, 2500=0.00693 (USD); Supplier 3: Digi-Key; Supplier Part Number 3: P470GDKR-ND; Stock 3: 2783393; Pricing 3: 1=0.1, 10=0.043, 100=0.0176, 1000=0.00791, 2500=0.00686 (USD); Mount: Surface Mount; Weight: 7.1E-05oz; Contact Plating: Tin; Radiation Hardening: No; ComponentLink3URL: http://www.farnell.com/datasheets/1678796.pdf; ComponentLink3Description: http://www.farnell.com/datasheets/1678796.pdf; ComponentLink4URL: http://industrial.panasonic.com/www-data/pdf/AOA0000/AOA0000CE1.pdf; ComponentLink4Description: http://industrial.panasonic.com/www-data/pdf/AOA0000/AOA0000CE1.pdf; ComponentLink5URL: https://www.alliedelec.com/m/d/51cd0790071e1666bdb9d00c57fcf960.pdf; ComponentLink5Description: https://www.alliedelec.com/m/d/51cd0790071e1666bdb9d00c57fcf960.pdf; ComponentLink6URL: https://www.verical.com/server-webapp/html/getDatasheet?partID=33087; ComponentLink6Description: https://www.verical.com/server-webapp/html/getDatasheet?partID=33087; ComponentLink7URL: http://www.farnell.com/datasheets/2059623.pdf; ComponentLink7Description: http://www.farnell.com/datasheets/2059623.pdf; ComponentLink8URL: https://www.verical.com/server-webapp/html/getDatasheet?partID=493439; ComponentLink8Description: https://www.verical.com/server-webapp/html/getDatasheet?partID=493439; .SCHCHK: USED
R30 = R-0R-0603 3 Pad: RES SMD 0 OHM 1/10W JUMP 0603; Manufacturer: Yageo; Manufacturer Part Number: RC0603JR-070RL; Resistance: 0mR; Tolerance: 1%; Power Rating: 100mW; Voltage Rating (DC): 50V; Temperature Coefficient: 200ppm/°C; Current Rating: 1A; Working Voltage: 75V; .PCBCHK: USED; .Creator: F:TALI; Washability: OK; Supplier 1: Digi-Key; Supplier Part Number 1: 311-0.0GRDKR-ND; Stock 1: 54397731; Pricing 1: 1=0.1, 10=0.021, 25=0.0152, 50=0.0114, 100=0.0084, 250=0.00644, 500=0.00514, 1000=0.00379 (USD); Case/Package: 0603; Number of Pins: 2; Contact Plating: Matte,Tin; Case Code (Metric): 1608; Min Operating Temperature: -55°C; Max Operating Temperature: 155°C; Composition: Thick Film; Packaging: Tape and Reel; Termination: SMD/SMT; Package Quantity: 5000; Voltage Rating: 50V; Military Standard: Not; Length: 1.6mm; Height: 0.45mm; Width: 0.8mm; Depth: 0.8mm; Radiation Hardening: No; REACH SVHC: No SVHC; Lead Free: Lead Free; ComponentLink1URL: http://www.farnell.com/datasheets/1738695.pdf; ComponentLink1Description: http://www.farnell.com/datasheets/1738695.pdf; ComponentLink2URL: https://www.verical.com/server-webapp/html/getDatasheet?partID=329462; ComponentLink2Description: https://www.verical.com/server-webapp/html/getDatasheet?partID=329462; ComponentLink3URL: http://www.yageo.com/documents/recent/PYu-RC_Group_51_RoHS_L_9.pdf; ComponentLink3Description: http://www.yageo.com/documents/recent/PYu-RC_Group_51_RoHS_L_9.pdf; ComponentLink4URL: http://www.farnell.com/datasheets/443971.pdf; ComponentLink4Description: http://www.farnell.com/datasheets/443971.pdf; ComponentLink5URL: http://documents.rs-components.com/techlib://itc_doclist_GB.htm?stockno=6515918; ComponentLink5Description: http://documents.rs-components.com/techlib://itc_doclist_GB.htm?stockno=6515918; Supplier 2: Digi-Key; Supplier Part Number 2: 311-0.0HRDKR-ND; Stock 2: 6104331; Pricing 2: 1=0.1, 10=0.021, 25=0.0152, 50=0.0114, 100=0.0084, 250=0.00644, 500=0.00514, 1000=0.00379 (USD); Number of Terminations: 2; Max Power Dissipation: 100mW; Features: Moisture Resistant; ComponentLink6URL: http://www.farnell.com/datasheets/1868787.pdf; ComponentLink6Description: http://www.farnell.com/datasheets/1868787.pdf; ComponentLink7URL: http://documents.rs-components.com/techlib://itc_doclist_GB.htm?stockno=5048827; ComponentLink7Description: http://documents.rs-components.com/techlib://itc_doclist_GB.htm?stockno=5048827; Supplier 3: Digi-Key; Supplier Part Number 3: P0.0GDKR-ND; Stock 3: 34178498; Pricing 3: 1=0.1, 10=0.042, 25=0.0304, 50=0.0232, 100=0.0171, 250=0.01308, 500=0.01046, 1000=0.0077 (USD); Mount: Surface Mount; ComponentLink8URL: http://industrial.panasonic.com/www-data/pdf/AOA0000/AOA0000CE1.pdf; ComponentLink8Description: http://industrial.panasonic.com/www-data/pdf/AOA0000/AOA0000CE1.pdf; ComponentLink9URL: http://www.farnell.com/datasheets/2059623.pdf; ComponentLink9Description: http://www.farnell.com/datasheets/2059623.pdf; ComponentLink10URL: http://www.jameco.com/Jameco/Products/ProdDS/1935748.pdf; ComponentLink10Description: http://www.jameco.com/Jameco/Products/ProdDS/1935748.pdf; ComponentLink11URL: http://www.farnell.com/datasheets/1678796.pdf; ComponentLink11Description: http://www.farnell.com/datasheets/1678796.pdf; ComponentLink12URL: http://www.alliedelec.com/m/d/51cd0790071e1666bdb9d00c57fcf960.pdf; ComponentLink12Description: http://www.alliedelec.com/m/d/51cd0790071e1666bdb9d00c57fcf960.pdf; .SCHCHK: USED
R43 R45 = R-5K11-0603: RES SMD 5.11KOHM 0.1% 1/10W 0603; Manufacturer: Panasonic; Manufacturer Part Number: ERA-3AEB5111V; Resistance: 5.11kR; Power Rating: 100mW; Voltage Rating: 75V; Temperature Coefficient: 25ppm/°C; Supplier 1: Digi-Key; Supplier Part Number 1: P5.11KDBCT-ND; Case/Package: 0603; Number of Pins: 2; Case Code (Metric): 1608; Min Operating Temperature: -55°C; Max Operating Temperature: 155°C; Tolerance: 0.1%; Packaging: Tape and Reel; Termination: SMD/SMT; Composition: Thin Film,Metal Film; Military Standard: Not; Voltage Rating (DC): 75V; Length: 1.6mm; Depth: 0.8mm; REACH SVHC: No SVHC; Lead Free: Lead Free; Mount: Surface Mount; Weight: 7.1E-05oz; Contact Plating: Tin; Package Quantity: 5000; Number of Terminations: 2; Max Power Dissipation: 100mW; Features: Automotive AEC-Q200; Height: 0.45mm; Width: 0.8mm; Radiation Hardening: No; ComponentLink1URL: https://datasheet.ciiva.com/11810/0900766b80eb1d8c-11810822.pdf?src-supplier=RSComponents; ComponentLink1Description: https://datasheet.ciiva.com/11810/0900766b80eb1d8c-11810822.pdf?src-supplier=RSComponents; ComponentLink2URL: https://datasheet.ciiva.com/29183/451892-da-01-en-widerstand-0603-era-29183907.pdf?src-supplier=Conrad; ComponentLink2Description: https://datasheet.ciiva.com/29183/451892-da-01-en-widerstand-0603-era-29183907.pdf?src-supplier=Conrad; ComponentLink3URL: https://datasheet.ciiva.com/24159/aoa0000ce26-197354-24159541.pdf?src-supplier=Mouser; ComponentLink3Description: https://datasheet.ciiva.com/24159/aoa0000ce26-197354-24159541.pdf?src-supplier=Mouser; ComponentLink4URL: https://datasheet.ciiva.com/5968/485442-5968872.pdf?src-supplier=Farnell; ComponentLink4Description: https://datasheet.ciiva.com/5968/485442-5968872.pdf?src-supplier=Farnell; ComponentLink5URL: https://datasheet.ciiva.com/5968/485442-5968873.pdf?src-supplier=Farnell; ComponentLink5Description: https://datasheet.ciiva.com/5968/485442-5968873.pdf?src-supplier=Farnell; ComponentLink6URL: https://datasheet.ciiva.com/5968/485442-5968874.pdf?src-supplier=Farnell; ComponentLink6Description: https://datasheet.ciiva.com/5968/485442-5968874.pdf?src-supplier=Farnell; ComponentLink7URL: https://datasheet.ciiva.com/9195/aoa0000ce26-9195515.pdf?src-supplier=Avnet; ComponentLink7Description: https://datasheet.ciiva.com/9195/aoa0000ce26-9195515.pdf?src-supplier=Avnet; ComponentLink8URL: https://datasheet.ciiva.com/5968/485442-5968876.pdf?src-supplier=Farnell; ComponentLink8Description: https://datasheet.ciiva.com/5968/485442-5968876.pdf?src-supplier=Farnell; ComponentLink9URL: https://datasheet.ciiva.com/7861/485442-7861692.pdf?src-supplier=Element14; ComponentLink9Description: https://datasheet.ciiva.com/7861/485442-7861692.pdf?src-supplier=Element14; Stock: 711; Pricing: 1=0.33, 10=0.275, 100=0.1076, 1000=0.045, 2500=0.0413 (USD); RoHS: Yes; ComponentLink10URL: https://datasheet.ciiva.com/7861/485442-7861693.pdf?src-supplier=Element14; ComponentLink10Description: https://datasheet.ciiva.com/7861/485442-7861693.pdf?src-supplier=Element14
R44 R46 = R-22K-0603: RES SMD 22K OHM 1% 1/8W 0603; Manufacturer: Vishay Beyschlag; Manufacturer Part Number: MCT06030C2202FP500; Resistance: 22kR; Power Rating: 125mW; Temperature Coefficient: 50ppm/°C; .Creator: F:TALI; .PCBCHK: USED; Washability: OK; Voltage Rating: 75V; Supplier 1: Digi-Key; Stock 1: 132469; Pricing 1: 1=0.18, 10=0.152, 100=0.0596, 1000=0.02495, 2500=0.02287 (USD); Case/Package: 0603; Case Code (Metric): 1608; Contact Plating: Tin; Min Operating Temperature: -55°C; Max Operating Temperature: 125°C; Tolerance: 1%; Packaging: Tape and Reel; Composition: Thin Film; Number of Terminations: 2; Max Power Dissipation: 125mW; Length: 0.061inch; Height: 0.022inch; Width: 0.033inch; Radiation Hardening: No; Lead Free: Lead Free; Supplier Part Number 1: MCT0603-22.0K-CFDKR-ND; .SCHCHK: USED; Package Quantity: 5000; Military Standard: Not; Voltage Rating (DC): 75V; Depth: 0.85mm; REACH SVHC: No SVHC; ComponentLink1URL: http://www.vishay.com/docs/28705/mc_pro.pdf; ComponentLink1Description: http://www.vishay.com/docs/28705/mc_pro.pdf